# Altium project 通信工程(专升本)2101-210806300163-李烨攀-单片机控制流水灯电路.PrjPcb
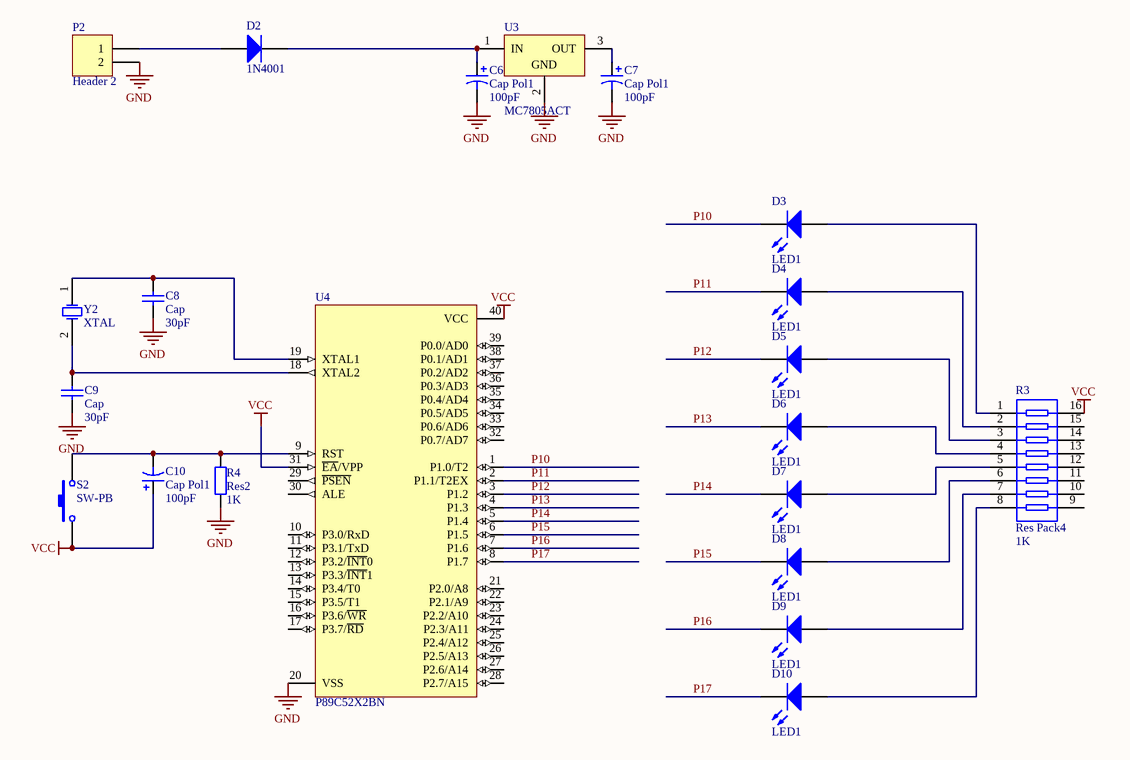
[diagram p0: 通信工程(专升本)2101-210806300163-李烨攀-单片机控制流水灯电路.SchDoc]
1 sheet, 21 parts. Net scope: global (net labels, ports and power ports of the same name join across sheets).
Board files: 通信工程(专升本)2101-210806300163-李烨攀-单片机控制流水灯电路.PcbDoc, 单片机控制流水灯电路.PcbDoc

## Sheet 通信工程(专升本)2101-210806300163-李烨攀-单片机控制流水灯电路.SchDoc
size A4

### Parts
C6  Cap Pol1  value 100pF  [RB7.6-15]
C7  Cap Pol1  value 100pF  [RB7.6-15]
C8  Cap  value 30pF  [RAD-0.3]
C9  Cap  value 30pF  [RAD-0.3]
C10  Cap Pol1  value 100pF  [RB7.6-15]
D2  1N4001  [DO-41]
D3  LED1  [LED-1]
D4  LED1  [LED-1]
D5  LED1  [LED-1]
D6  LED1  [LED-1]
D7  LED1  [LED-1]
D8  LED1  [LED-1]
D9  LED1  [LED-1]
D10  LED1  [LED-1]
P2  Header 2  [HDR1X2]
R3  Res Pack4  value 1K  [SSOP16_N]
R4  Res2  value 1K  [AXIAL-0.4]
S2  SW-PB  [SPST-2]
U3  MC7805ACT  [221A-04]
U4  P89C52X2BN  [SOT129-1]
Y2  XTAL  [R38]

### Nets
GND: C6.2 C7.2 C8.1 C9.1 P2.2 R4.1 U3.2(GND) U4.20(VSS)
VCC: C10.1 R3.16 S2.1 U4.31(~{EA}/VPP) U4.40(VCC)
P10: D3.2(K) U4.1(P1.0/T2)
P11: D4.2(K) U4.2(P1.1/T2EX)
P12: D5.2(K) U4.3(P1.2)
P13: D6.2(K) U4.4(P1.3)
P14: D7.2(K) U4.5(P1.4)
P15: D8.2(K) U4.6(P1.5)
P16: D9.2(K) U4.7(P1.6)
P17: D10.2(K) U4.8(P1.7)
NetC6_1: C6.1 D2.2(K) U3.1(IN)
NetC7_1: C7.1 U3.3(OUT)
NetC8_2: C8.2 U4.19(XTAL1) Y2.1(OSC1)
NetC9_2: C9.2 U4.18(XTAL2) Y2.2(OSC2)
NetC10_2: C10.2 R4.2 S2.2 U4.9(RST)
NetD2_1: D2.1(A) P2.1
NetD3_1: D3.1(A) R3.1
NetD4_1: D4.1(A) R3.2
NetD5_1: D5.1(A) R3.3
NetD6_1: D6.1(A) R3.4
NetD7_1: D7.1(A) R3.5
NetD8_1: D8.1(A) R3.6
NetD9_1: D9.1(A) R3.7
NetD10_1: D10.1(A) R3.8

Not connected (* = marked no-connect by the designer): R3 9 10 11 12 13 14 15; U4 10(P3.0/RxD) 11(P3.1/TxD) 12(P3.2/~{INT}0) 13(P3.3/~{INT}1) 14(P3.4/T0) 15(P3.5/T1) 16(P3.6/~{WR}) 17(P3.7/~{RD}) 21(P2.0/A8) 22(P2.1/A9) 23(P2.2/A10) 24(P2.3/A11) 25(P2.4/A12) 26(P2.5/A13) 27(P2.6/A14) 28(P2.7/A15) 29(~{PSEN}) 30(ALE) 32(P0.7/AD7) 33(P0.6/AD6) 34(P0.5/AD5) 35(P0.4/AD4) 36(P0.3/AD3) 37(P0.2/AD2) 38(P0.1/AD1) 39(P0.0/AD0)

### Notes on the sheet
- 专升本
- 通信工程
- 李烨攀
- 2101班
- 210806300163
- 学号

### Library data of the parts
C6 C7 C10 = Cap Pol1: Polarized Capacitor (Radial); Published: 8-Jun-2000; LatestRevisionDate: 17-Jul-2002; LatestRevisionNote: Re-released for DXP Platform.; PackageReference: RB7.6-15; Publisher: Altium Limited; PackageDescription: Polarized Capacitor (Radial); 2 Leads
C8 C9 = Cap: Capacitor; Published: 8-Jun-2000; LatestRevisionDate: 17-Jul-2002; LatestRevisionNote: Re-released for DXP Platform.; PackageReference: RAD-0.3; Publisher: Altium Limited; PackageDescription: Radial Cap, Thru-Hole; 2 Leads; 0.3 in Pin Spacing
D2 = 1N4001: 1.0 Ampere General Purpose Rectifier; Published: 8-Jun-2000; LatestRevisionDate: 17-Jul-2002; LatestRevisionNote: Re-released for DXP Platform.; DatasheetDocument: 1998; PackageDocument: Aug-1999; PackageReference: DO-41; Publisher: Altium Limited; Code_JEDEC: DO-204-AL; ComponentLink1Description: Manufacturer Link; ComponentLink1URL: http://www.fairchildsemi.com/; ComponentLink2Description: Pinout Specification; ComponentLink2URL: http://www.fairchildsemi.com/ds/1N%2F1N4001.pdf
D3-D10 = LED1: Typical RED GaAs LED; Published: 8-Jun-2000; LatestRevisionDate: 08-Jul-2005; LatestRevisionNote: Mech Layer 1 removed.; PackageReference: LED-1; Publisher: Altium Limited; PackageDescription: LED; 2 Leads
P2 = Header 2: Header, 2-Pin; LatestRevisionDate: 17-Jul-2002; LatestRevisionNote: Re-released for DXP Platform.; Publisher: Altium Limited
R3 = Res Pack4: Isolated Resistor Network; Published: 24-Mar-1999; LatestRevisionDate: 29-May-2009; LatestRevisionNote: IPC-7351 Footprint Added.; PackageVersion: Oct-2003; PackageReference: SSOP16; Publisher: Altium Limited; PackageDescription: 16-Pin Plastic Small Outline Package 0.65 mm Pitch; Code_JEDEC: MO-150-AC; Code_IPC: SOP65P780-16
R4 = Res2: Resistor; Published: 8-Jun-2000; LatestRevisionDate: 17-Jul-2002; LatestRevisionNote: Re-released for DXP Platform.; PackageReference: AXIAL-0.4; Publisher: Altium Limited; PackageDescription: Axial Device, Thru-Hole; 2 Leads; 0.4 in Pin Spacing
S2 = SW-PB: Switch; Published: 24-Mar-1999; LatestRevisionDate: 17-Jul-2002; LatestRevisionNote: Re-released for DXP Platform.; PackageReference: SPST-2; Publisher: Altium Limited; PackageDescription: Switch; 2 Leads
U3 = MC7805ACT: 3-Terminal Positive Fixed Voltage Regulator; Note: Pin 2 is electrically connected to TAB; Published: 17-Jul-2002; DatasheetVersion: 1988; PackageReference: 221A-04; Publisher: Altium Limited; PackageDescription: TO, Thru-Hole, Vertical, Heatsink Mounted; 3 In-Line Leads; Pitch 2.54 mm; Code_JEDEC: TO-262-AA; ComponentLink1Description: Manufacturer Link; ComponentLink1URL: http://www.onsemi.com/site/products/taxonomy/0,4438,503,00.html; ComponentLink2Description: Datasheet; ComponentLink2URL: http://www.onsemi.com/pub/Collateral/MC7800-D.PDF
U4 = P89C52X2BN: 80C51 8-Bit Flash Microcontroller Family, 8 kB Flash; Published: 21-May-2003; DatasheetVersion: 5-Jun-2002; PackageVersion: Aug-2000; PackageReference: SOT129-1; Publisher: Altium Limited; PackageDescription: DIP, Plastic; 40 Leads; Row Spacing 15.24 mm; Pitch 2.54 mm; Code_JEDEC: MO-015; ComponentLink1Description: Manufacturer Link; ComponentLink1URL: http://www-us2.semiconductors.philips.com/; ComponentLink2Description: Datasheet; ComponentLink2URL: http://www.semiconductors.philips.com/acrobat/datasheets/P89C5XX2_2.pdf
Y2 = XTAL: Crystal Oscillator; Published: 8-Jun-2000; LatestRevisionDate: 17-Jul-2002; LatestRevisionNote: Re-released for DXP Platform.; PackageReference: R38; Publisher: Altium Limited; PackageDescription: Crystal, Thru-Hole; 2 Leads; Body 3.1 x 8.2 mm (Dia.xH)